# EAGLE design HTTP_POST_RELAY (EAGLE 9.5.2)
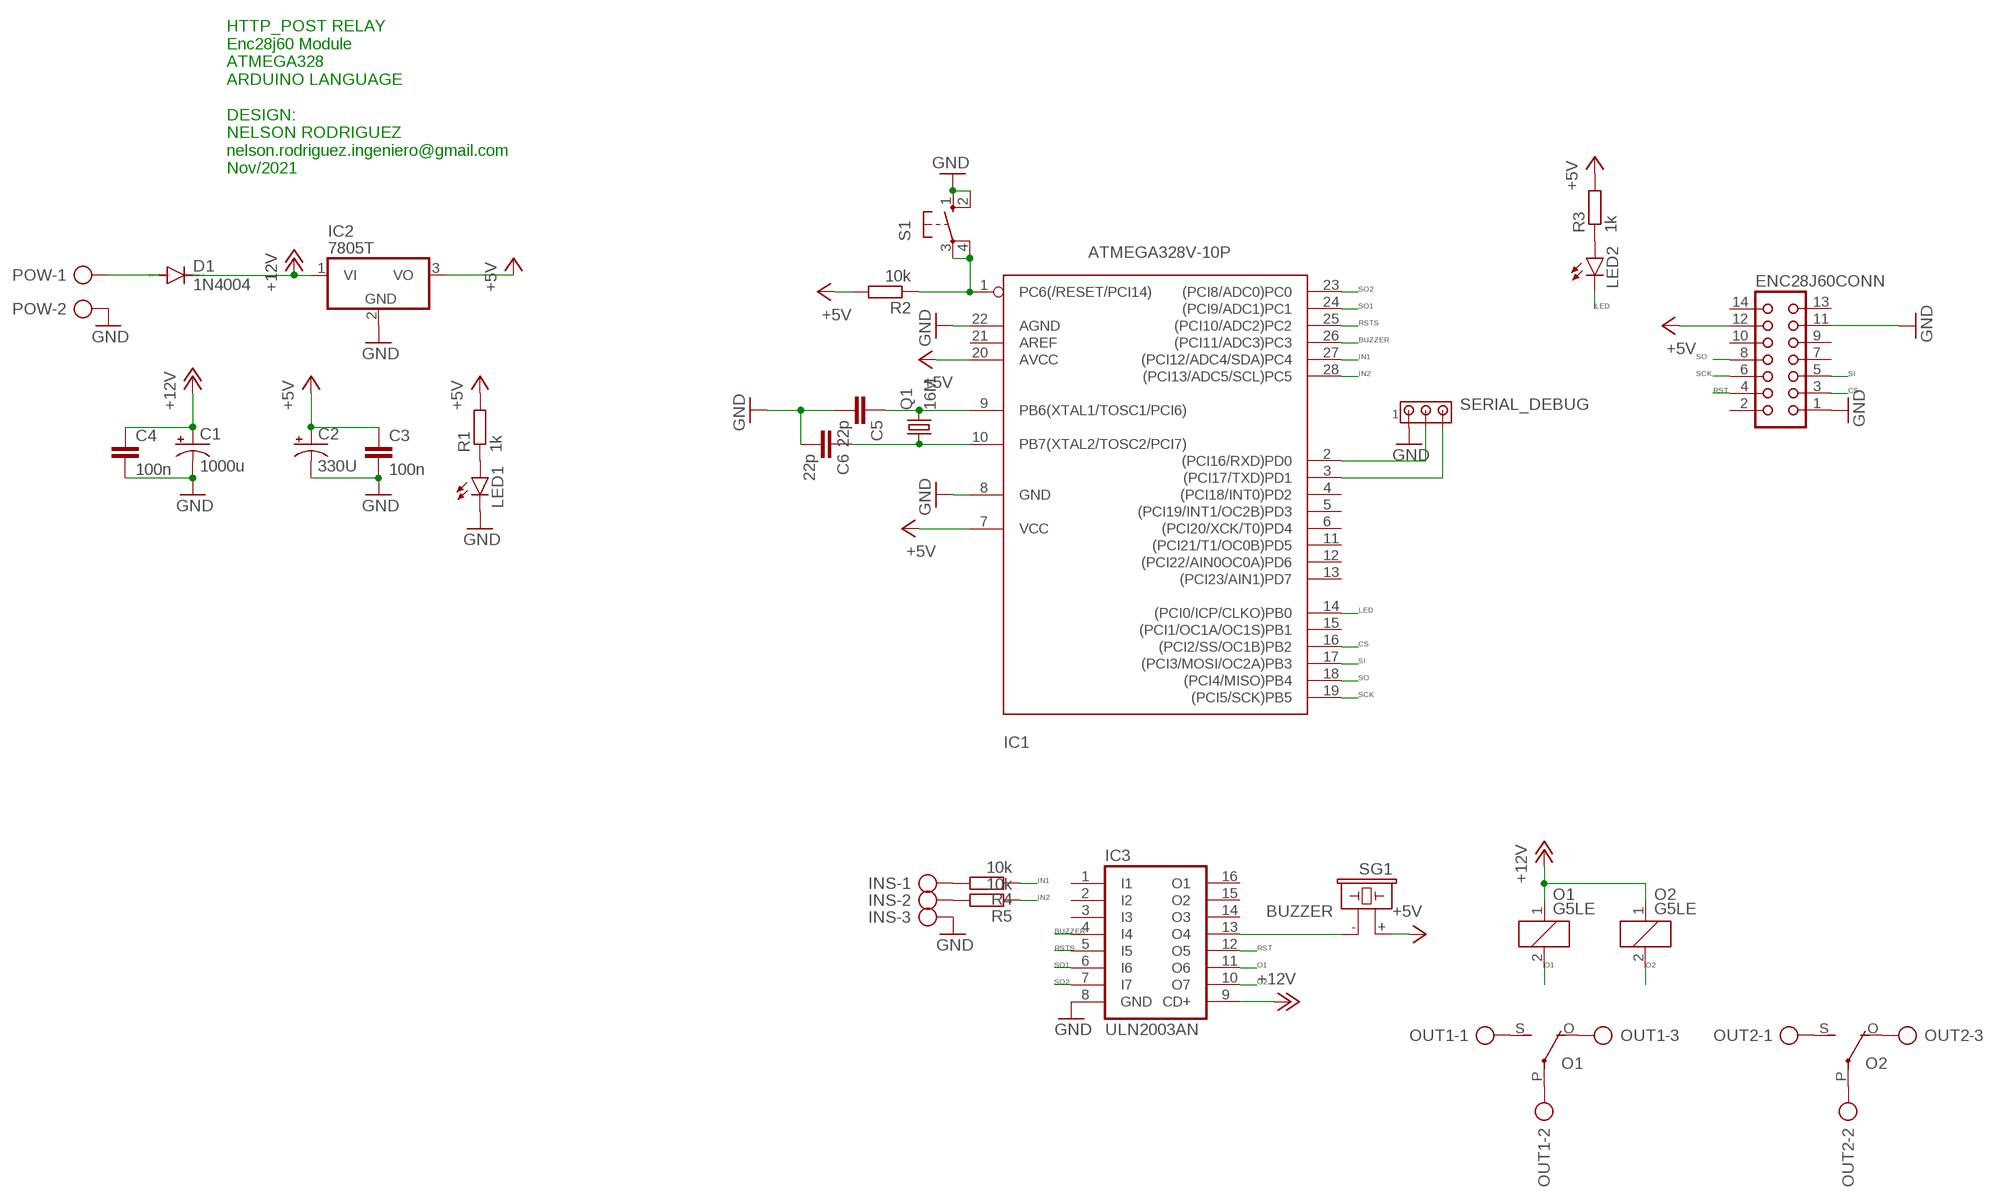
[diagram p0: schematic, sheet 1]

## Parts
C1  1000u  CPOL-USE2.5-6  [E2,5-6]
C2  330U  CPOL-USE2.5-6  [E2,5-6]
C3  100n  C-EU025-024X044  [C025-024X044]
C4  100n  C-EU025-024X044  [C025-024X044]
C5  22p  C-EU025-024X044  [C025-024X044]
C6  22p  C-EU025-024X044  [C025-024X044]
D1  1N4004  [DO41-10]
ENC28J60CONN  CON14  [CON14]
IC1  ATMEGA328V-10P  [DIL28-3]
IC2  7805T  [TO220H]
IC3  ULN2003AN  [DIL16]
INS  AK300/3  [AK300/3]
LED1  LED5MM  [LED5MM]
LED2  LED5MM  [LED5MM]
O1  G5LE  [G5LE]
O2  G5LE  [G5LE]
OUT1  AK300/3  [AK300/3]
OUT2  AK300/3  [AK300/3]
POW  AK300/2  [AK300/2]
Q1  16M  CRYSTALHC49U-V  [HC49U-V]
R1  1k  R-EU_0204/7  [0204/7]
R2  10k  R-EU_0204/7  [0204/7]
R3  1k  R-EU_0204/7  [0204/7]
R4  10k  R-EU_0204/7  [0204/7]
R5  10k  R-EU_0204/7  [0204/7]
S1  10-XX  [B3F-10XX]
SERIAL_DEBUG  MTA03-100  [10X03MTA]
SG1  BUZZER  F/CM12P  [F/CM12P]

## Nets
+5V: C2.+ C3.1 ENC28J60CONN.12 IC1.7(VCC) IC1.20(AVCC) IC2.3(VO) R1.2 R2.2 R3.2 SG1.+
+12V: C1.+ C4.1 D1.C IC2.1(VI) IC3.9(CD+) O1.1 O2.1
BUZZER: IC1.26((PCI11/ADC3)PC3) IC3.4(I4)
CS: ENC28J60CONN.3 IC1.16((PCI2/SS/OC1B)PB2)
GND: C1.- C2.- C3.2 C4.2 C5.2 C6.2 ENC28J60CONN.1 ENC28J60CONN.11 IC1.8(GND) IC1.22(AGND) IC2.2(GND) IC3.8(GND) INS.3 LED1.K(C) POW.2 S1.1(S) S1.2(S1) SERIAL_DEBUG.1
IN1: IC1.27((PCI12/ADC4/SDA)PC4) R4.1
IN2: IC1.28((PCI13/ADC5/SCL)PC5) R5.1
LED: IC1.14((PCI0/ICP/CLKO)PB0) LED2.K(C)
N$1: D1.A POW.1
N$2: LED1.A R1.1
N$3: C6.1 IC1.10(PB7(XTAL2/TOSC2/PCI7)) Q1.1
N$4: C5.1 IC1.9(PB6(XTAL1/TOSC1/PCI6)) Q1.2
N$5: IC1.2((PCI16/RXD)PD0) SERIAL_DEBUG.2
N$6: IC1.1(PC6(/RESET/PCI14)) R2.1 S1.3(P) S1.4(P1)
N$7: IC1.3((PCI17/TXD)PD1) SERIAL_DEBUG.3
N$8: LED2.A R3.1
N$9: IC3.13(O4) SG1.-
N$12: INS.1 R4.2
N$13: INS.2 R5.2
N$14: O1.P(2:P) OUT1.2
N$15: O1.S(2:S) OUT1.1
N$16: O1.O(2:O) OUT1.3
N$17: O2.P(2:P) OUT2.2
N$18: O2.S(2:S) OUT2.1
N$19: O2.O(2:O) OUT2.3
O1: IC3.11(O6) O1.2
O2: IC3.10(O7) O2.2
RST: ENC28J60CONN.4 IC3.12(O5)
RSTS: IC1.25((PCI10/ADC2)PC2) IC3.5(I5)
SCK: ENC28J60CONN.6 IC1.19((PCI5/SCK)PB5)
SI: ENC28J60CONN.5 IC1.17((PCI3/MOSI/OC2A)PB3)
SO: ENC28J60CONN.8 IC1.18((PCI4/MISO)PB4)
SO1: IC1.24((PCI9/ADC1)PC1) IC3.6(I6)
SO2: IC1.23((PCI8/ADC0)PC0) IC3.7(I7)
Unconnected: ENC28J60CONN.2 ENC28J60CONN.7 ENC28J60CONN.9 ENC28J60CONN.10 ENC28J60CONN.13 ENC28J60CONN.14 IC1.4((PCI18/INT0)PD2) IC1.5((PCI19/INT1/OC2B)PD3) IC1.6((PCI20/XCK/T0)PD4) IC1.11((PCI21/T1/OC0B)PD5) IC1.12((PCI22/AIN0OC0A)PD6) IC1.13((PCI23/AIN1)PD7) IC1.15((PCI1/OC1A/OC1S)PB1) IC1.21(AREF) IC3.1(I1) IC3.2(I2) IC3.3(I3) IC3.14(O3) IC3.15(O2) IC3.16(O1)

## Notes on the sheet
- HTTP_POST RELAY
  Enc28j60 Module
  ATMEGA328
  ARDUINO LANGUAGE
  
  DESIGN:
  NELSON RODRIGUEZ
  nelson.rodriguez.ingeniero@gmail.com
  Nov/2021

## Library data of the parts
C1 C2 = rcl-nelson:CPOL-US: POLARIZED CAPACITOR, American symbol; SPICEPREFIX: C
C3-C6 = rcl-nelson:C-EU: CAPACITOR, European symbol; SPICEPREFIX: C
D1 = diode:1N4004: DIODE general purpose rectifier, 1 A
ENC28J60CONN = con-harting-nelson:CON14: CONNECTOR; OC_FARNELL: unknown; OC_NEWARK: unknown
IC1 = atmega328:ATMEGA328*P: MICROCONTROLLER 32 kBytes FLASH 2 kBytes SRAM 1 kBytes EEPROM USART 8-channel 10 bit ADC
IC2 = linear-nelson:78*: Positive VOLTAGE REGULATOR Source: http://cache.national.com/ds/LM/LM78L05.pdf http://www.fairchildsemi.com/ds/LM/LM7805.pdf
IC3 = uln-udn:ULN2003A: DRIVER ARRAY
INS OUT1 OUT2 = con-ptr500:AK300/3: CONNECTOR; OC_FARNELL: unknown; OC_NEWARK: unknown
LED1 LED2 = led:LED: LED OSRAM: - CHIPLED LG R971, LG N971, LY N971, LG Q971, LY Q971, LO R971, LY R971 LH N974, LH R974 LS Q976, LO Q976, LY Q976 LO Q996 - Hyper CHIPLED LW Q18S LB Q993, LB Q99A, LB R99A - SideLED LS A670, LO A670, LY A670, LG A670, LP A670 LB A673, LV A673, LT A673, LW A673 LH A674 LY A675 LS A676, LA A676, LO A676, LY A676, LW A676 LS A679, LY A679, LG A679 - Hyper Micro SIDELED® LS Y876, LA Y876, LO Y876, LY Y876 LT Y87S - SmartLED LW L88C, LW L88S LB L89C, LB L89S, LG L890 LS L89K, LO L89K, LY L89K LS L896, LA L896, LO L896, LY L896 - TOPLED LS T670, LO T670, LY T670, LG T670, LP T670 LSG T670, LSP T670, LSY T670, LOP T670, LYG T670 LG T671, LOG T671, LSG T671 LB T673, LV T673, LT T673, LW T673 LH T674 LS T676, LA T676, LO T676, LY T676, LB T676, LH T676, LSB T676, LW T676 LB T67C, LV T67C, LT T67C, LS T67K, LO T67K, LY T67K, LW E67C LS E67B, LA E67B, LO E67B, LY E67B, LB E67C, LV E67C, LT E67C LW T67C LS T679, LY T679, LG T679 LS T770, LO T770, LY T770, LG T770, LP T770 LB T773, LV T773, LT T773, LW T773 LH T774 LS E675, LA E675, LY E675, LS T675 LS T776, LA T776, LO T776, LY T776, LB T776 LHGB T686 LT T68C, LB T68C - Hyper Mini TOPLED® LB M676 - Mini TOPLED Santana® LG M470 LS M47K, LO M47K, LY M47K Source: http://www.osram.convergy.de LUXEON: - LUMILED® LXK2-PW12-R00, LXK2-PW12-S00, LXK2-PW14-U00, LXK2-PW14-V00 LXK2-PM12-R00, LXK2-PM12-S00, LXK2-PM14-U00 LXK2-PE12-Q00, LXK2-PE12-R00, LXK2-PE12-S00, LXK2-PE14-T00, LXK2-PE14-U00 LXK2-PB12-K00, LXK2-PB12-L00, LXK2-PB12-M00, LXK2-PB14-N00, LXK2-PB14-P00, LXK2-PB14-Q00 LXK2-PR12-L00, LXK2-PR12-M00, LXK2-PR14-Q00, LXK2-PR14-R00 LXK2-PD12-Q00, LXK2-PD12-R00, LXK2-PD12-S00 LXK2-PH12-R00, LXK2-PH12-S00 LXK2-PL12-P00, LXK2-PL12-Q00, LXK2-PL12-R00 Source: www.luxeon.com KINGBRIGHT: KA-3528ASYC Source: www.kingbright.com
O1 O2 = relay:G5LE: RELAY 1 x switch, 10 A/120 V AC, 8 A/30 V DC, Omron; OC_FARNELL: unknown; OC_NEWARK: unknown
POW = con-ptr500:AK300/2: CONNECTOR; OC_FARNELL: unknown; OC_NEWARK: unknown
Q1 = crystal:CRYSTAL: CRYSTAL; OC_FARNELL: 1666969; OC_NEWARK: unknown
R1-R5 = rcl-nelson:R-EU_: RESISTOR, European symbol; SPICEPREFIX: R
S1 = switch-omron:10-XX: OMRON SWITCH; MPN: B3F-1000; OC_FARNELL: 176432; OC_NEWARK: 36M3542
SERIAL_DEBUG = con-amp:MTA03-100: AMP connector
SG1 = buzzer:F/CM12P: BUZZER Source: Buerklin; OC_FARNELL: unknown; OC_NEWARK: unknown

## Board
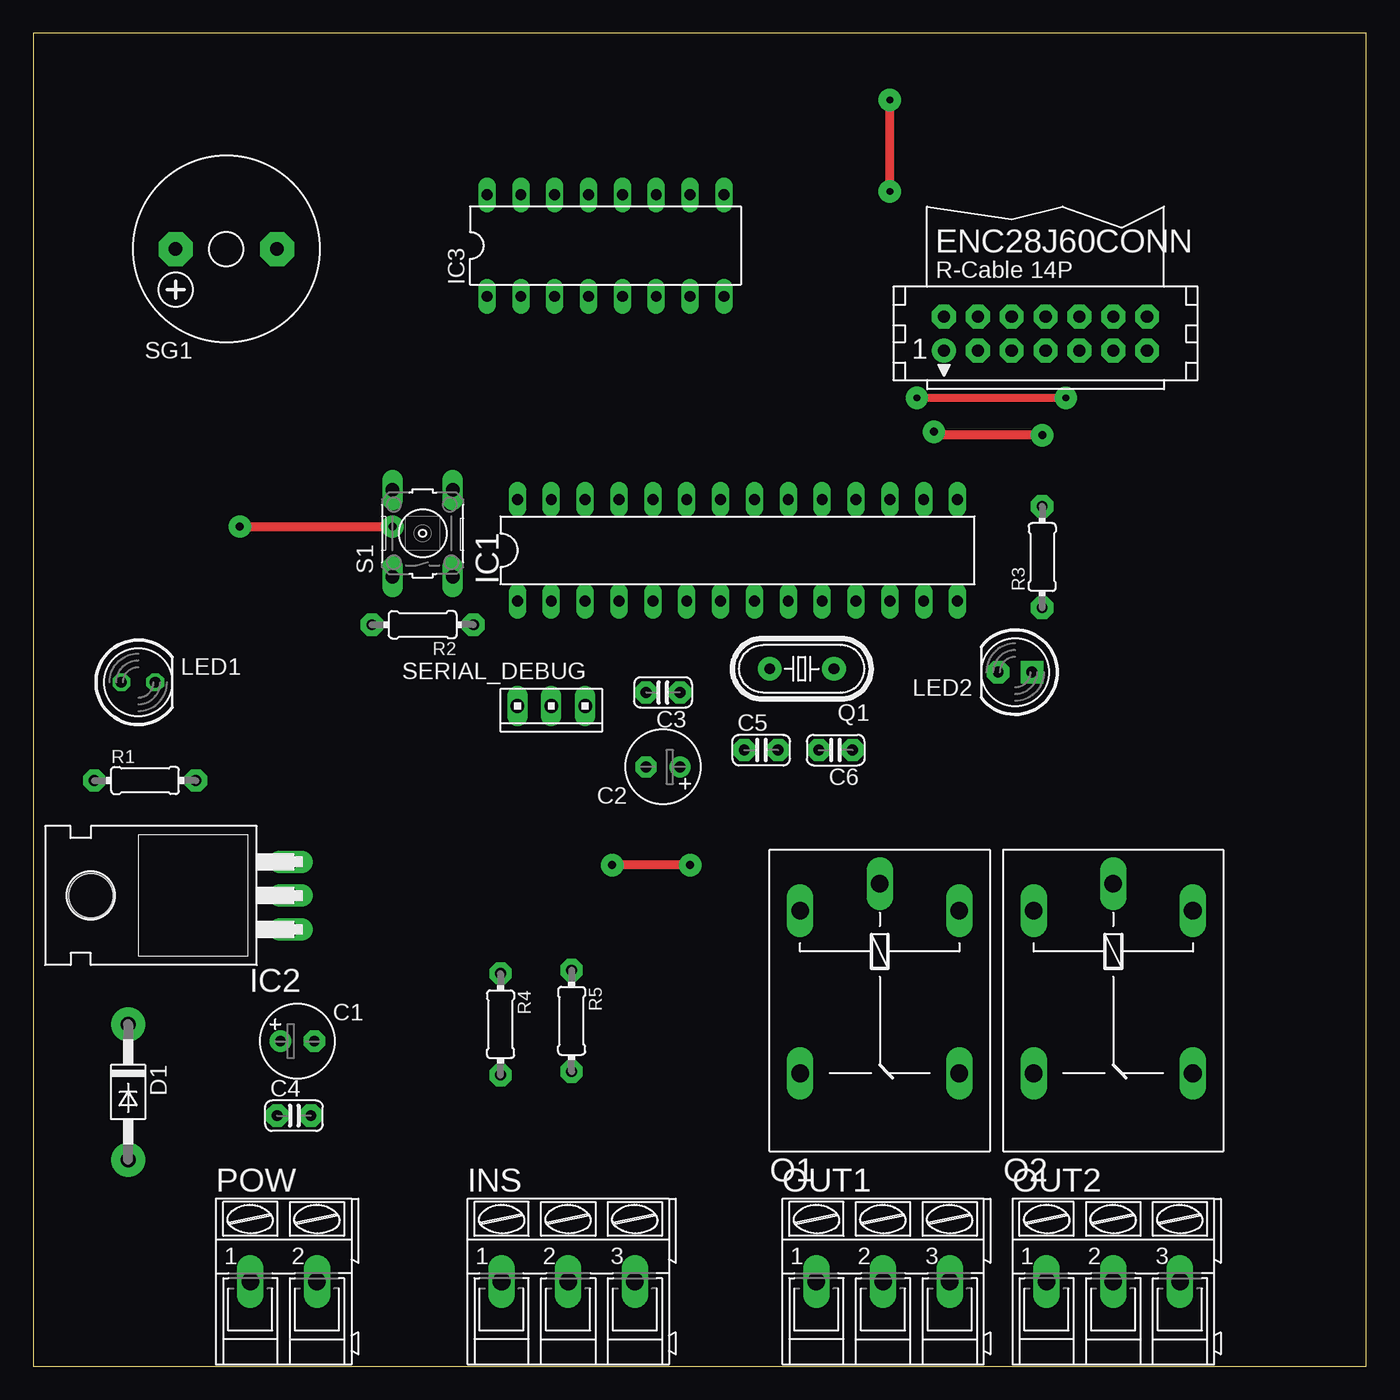
[diagram p1: board, top side]
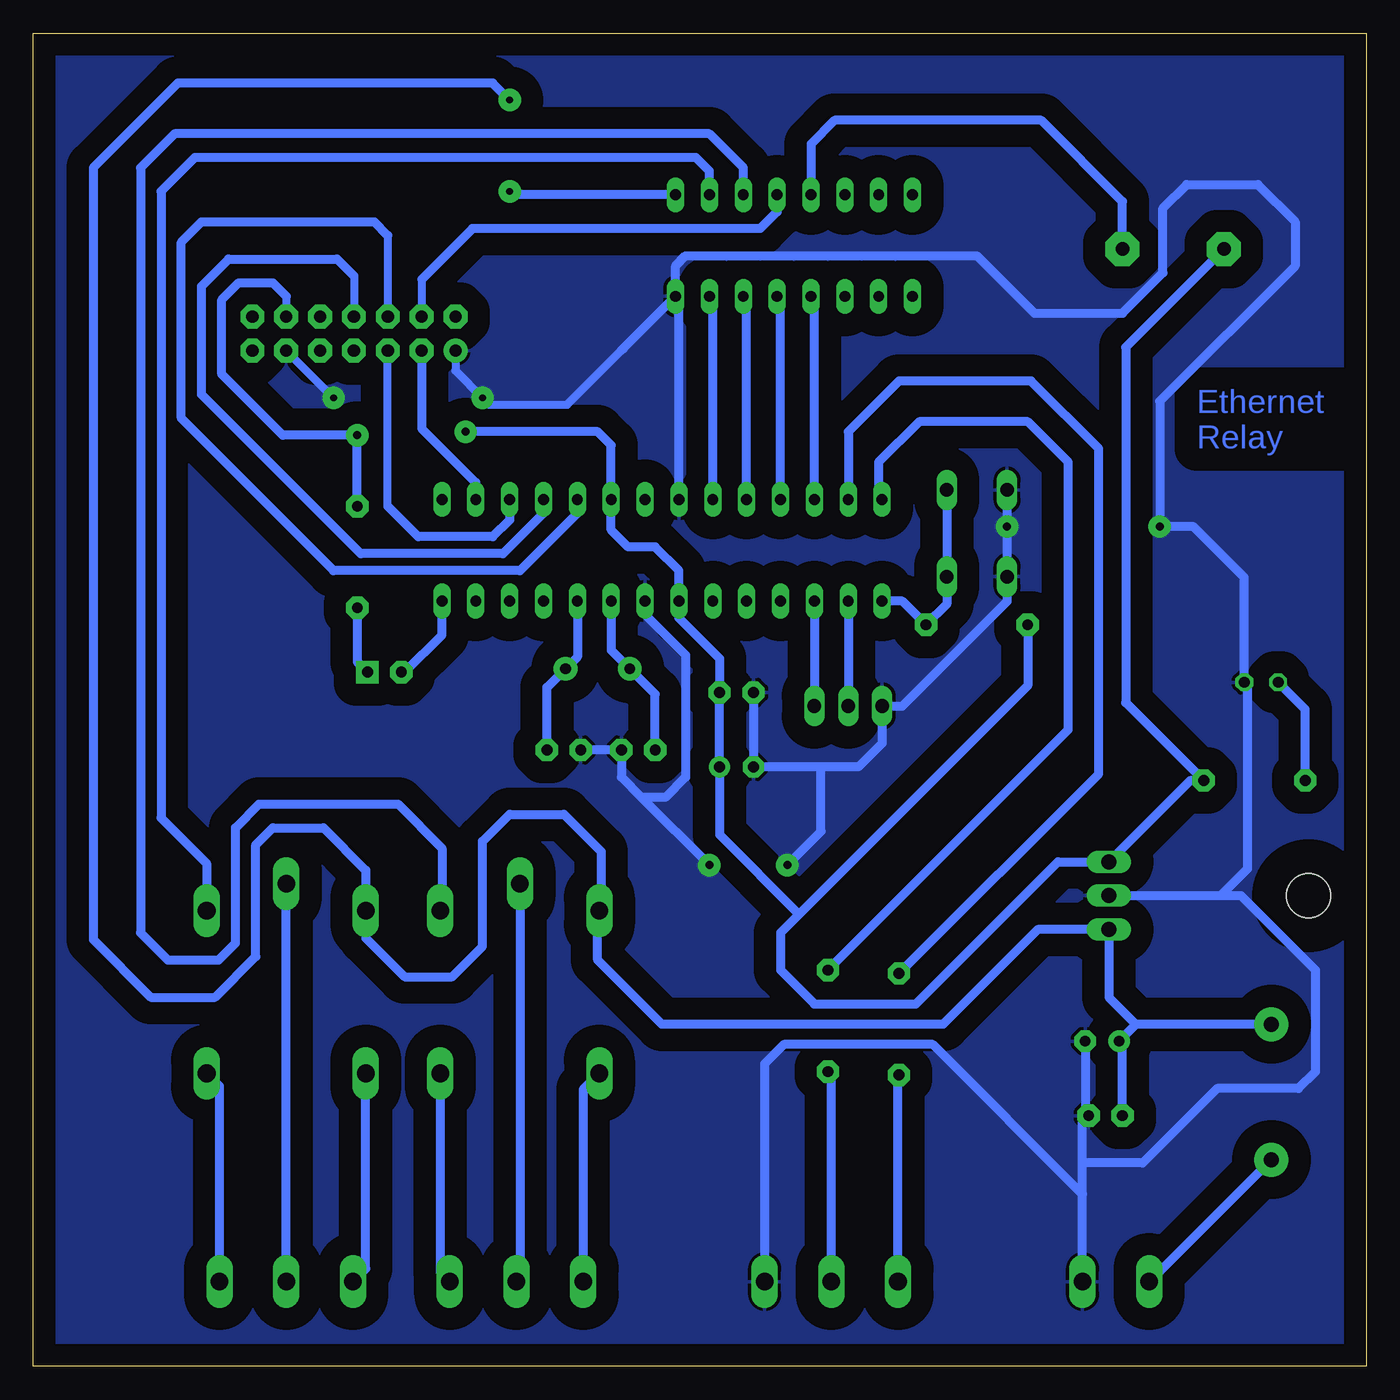
[diagram p2: board, bottom side, seen from below]

Size 100 x 100 mm. Coordinates in mm from the lower left corner, seen from the top.
Outline: 0,0 100,0 100,100 0,100 0,0
Copper layers (1*16): Top 0.035mm / dielectric 1.5mm / Bottom 0.035mm
Design rules "default": minimum track width 6mil, minimum drill 0.35mm, track to track 6mil, track to pad 6mil, pad to pad 6mil, via to via 6mil, smd to smd 6mil, copper to edge 40mil, drill to drill 6mil, minimum pad ring 10mil, minimum via ring 8mil, stop-mask expansion 4mil, vias tented up to drill 0mil, thermal gap 10mil

### Footprints (pad centres in the part's own frame; a part is rotated, then mirrored left to right if it is on the bottom)
E2,5-6 = drill 0.813 pad 1.6: + -1.27,0 | drill 0.813 pad 1.6 octagon: - 1.27,0
C025-024X044 = drill 0.813 pad 1.676 octagon: 1 -1.27,0; 2 1.27,0
DO41-10 = drill 1.118 pad 2.54: A 5.08,0; C -5.08,0
CON14 = drill 0.914 pad 1.778: 1 -7.62,-1.27 | drill 0.914 pad 1.778 octagon: 2 -7.62,1.27; 3 -5.08,-1.27; 4 -5.08,1.27; 5 -2.54,-1.27; 6 -2.54,1.27; 7 0,-1.27; 8 0,1.27; 9 2.54,-1.27; 10 2.54,1.27; 11 5.08,-1.27; 12 5.08,1.27; 13 7.62,-1.27; 14 7.62,1.27
DIL28-3 = drill 0.813 long: 1 -16.51,-3.81; 2 -13.97,-3.81; 3 -11.43,-3.81; 4 -8.89,-3.81; 5 -6.35,-3.81; 6 -3.81,-3.81; 7 -1.27,-3.81; 8 1.27,-3.81; 9 3.81,-3.81; 10 6.35,-3.81; 11 8.89,-3.81; 12 11.43,-3.81; 13 13.97,-3.81; 14 16.51,-3.81; 15 16.51,3.81; 16 13.97,3.81; 17 11.43,3.81; 18 8.89,3.81; 19 6.35,3.81; 20 3.81,3.81; 21 1.27,3.81; 22 -1.27,3.81; 23 -3.81,3.81; 24 -6.35,3.81; 25 -8.89,3.81; 26 -11.43,3.81; 27 -13.97,3.81; 28 -16.51,3.81
TO220H = drill 1.118 long: 1 -2.54,-10.16; 2 0,-10.16; 3 2.54,-10.16 | hole 3.302: 0,4.826
DIL16 = drill 0.813 long: 1 -8.89,-3.81; 2 -6.35,-3.81; 3 -3.81,-3.81; 4 -1.27,-3.81; 5 1.27,-3.81; 6 3.81,-3.81; 7 6.35,-3.81; 8 8.89,-3.81; 9 8.89,3.81; 10 6.35,3.81; 11 3.81,3.81; 12 1.27,3.81; 13 -1.27,3.81; 14 -3.81,3.81; 15 -6.35,3.81; 16 -8.89,3.81
AK300/3 = drill 1.321 long: 1 -5.004,0; 2 0,0; 3 5.004,0
LED5MM = drill 0.813 octagon: A -1.27,0; K 1.27,0
LED5MM' = drill 0.813 pad 1.676 square: A -1.27,0 | drill 0.813 pad 1.676 octagon: K 1.27,0
G5LE = drill 1.321 long: 1 -7.493,-5.969; 2 -7.493,5.969; O 4.699,5.969; P -9.525,0; S 4.699,-5.969
AK300/2 = drill 1.321 long: 1 -2.515,0; 2 2.489,0
HC49U-V = drill 0.813 pad 1.778: 1 -2.413,0; 2 2.413,0
0204/7 = drill 0.813 pad 1.676 octagon: 1 -3.81,0; 2 3.81,0
B3F-10XX = drill 1.016 long: 1 -3.251,2.261; 2 3.251,2.261; 3 -3.251,-2.261; 4 3.251,-2.261
10X03MTA = drill 1.016 long: 1 2.54,0; 2 0,0; 3 -2.54,0
F/CM12P = drill 1.016 pad 2.54 octagon: + 3.81,0; - -3.81,0

### Placement (x,y rotation side)
C1  19.81,24.38 0 top
C2  47.24,44.96 180 top
C3  47.24,50.55 180 top
C4  19.56,18.8 0 top
C5  54.61,46.23 0 top
C6  60.2,46.23 180 top
D1  7.11,20.57 270 top
ENC28J60CONN  75.95,77.47 0 top
IC1  52.83,61.21 0 top
IC2  9.14,35.31 90 top
IC3  42.93,84.07 0 top
INS  40.13,6.35 0 top
LED1  7.87,51.31 0 top
LED2  [LED5MM']  73.66,52.07 180 top
O1  63.5,26.67 270 top
O2  81.03,26.67 270 top
OUT1  63.75,6.35 0 top
OUT2  81.03,6.35 0 top
POW  18.8,6.35 0 top
Q1  57.66,52.32 180 top
R1  8.38,43.94 0 top
R2  29.21,55.63 180 top
R3  75.69,60.71 90 top
R4  35.05,25.65 270 top
R5  40.39,25.91 270 top
S1  29.21,62.48 90 top
SERIAL_DEBUG  38.86,49.53 180 top
SG1  14.48,83.82 180 top

### Tracks (layer width: path | path; a pad name or v marks a point on that pad's centre or on a via)
+5V  (via drill 0.6 pad 1.68)
  Top 0.66: v75.69,69.85 67.82,69.85 v67.56,70.1
  Bottom 0.61: 81.03,80.26 ENC28J60CONN.12
  Bottom 0.66: R2.2 25.4,51.05 42.55,33.91 | 42.55,33.91 43.94,32.51 43.94,29.72 41.4,27.18 33.78,27.18 23.11,37.85 IC2.3 13.21,43.94 R1.2 18.03,49.78 18.03,76.45 SG1.+ | 42.55,33.91 48.51,39.88 C2.+ C3.1 48.51,53.09 51.56,56.13 IC1.7 51.56,59.69 53.34,61.47 55.37,61.47 56.64,62.74 IC1.20 56.64,69.09 57.66,70.1 v67.56,70.1 | 81.03,80.26 82.04,81.28 84.58,81.28 85.85,80.01 85.85,74.42 81.28,69.85 v75.69,69.85 R3.2
+12V  (via drill 0.51 pad 1.68)
  Top 0.66: v64.26,88.14 v64.26,95
  Bottom 0.66: D1.C 17.27,25.65 | 17.27,25.65 C1.+ 18.29,24.13 C4.1 | 17.27,25.65 19.3,27.69 IC2.1 24.64,32.77 31.75,25.65 52.83,25.65 57.66,30.48 57.66,34.04 O1.1 57.4,34.29 57.4,38.61 60.2,41.4 64.26,41.4 66.29,39.37 66.29,31.5 68.58,29.21 72.14,29.21 75.06,32.13 O2.1 75.06,37.21 78.23,40.39 82.04,40.39 83.31,39.12 83.31,30.73 86.36,27.69 91.19,27.69 95.5,32 95.5,89.92 89.15,96.27 65.53,96.27 v64.26,95 | IC3.9 64.01,87.88 v64.26,88.14
BUZZER
  Bottom 0.66: IC1.26 41.4,80.01 IC3.4
CS
  Bottom 0.66: ENC28J60CONN.3 70.87,70.36 66.8,66.29 IC1.16
GND  (via drill 0.51 pad 1.68, 0.6 pad 1.68)
  Top 0.61: v77.47,72.64 v66.29,72.64
  Top 0.66: v15.49,62.99 v26.95,62.99 | v49.28,37.59 v43.43,37.59
  Bottom 0.61: ENC28J60CONN.11 v77.47,72.64 | 55.75,76.33 59.94,72.14 65.79,72.14 v66.29,72.64 68.33,74.68 ENC28J60CONN.1
  Bottom 0.66: IC1.22 51.56,80.01 IC3.8 | 55.88,76.2 55.75,76.33 IC3.8 | 21.29,15.24 POW.2 21.29,12.9 32.51,24.13 43.69,24.13 45.14,22.68 INS.3 | 21.29,15.24 21.29,18.34 C4.2 21.08,19.05 C1.- | S1.2 v26.95,62.99 S1.1 26.92,59.21 26.92,57.4 34.8,49.53 SERIAL_DEBUG.1 36.32,46.74 38.1,44.96 40.89,44.96 | C6.2 C5.2 55.88,44.2 54.36,42.67 | C3.2 C2.- 40.89,44.96 | IC1.8 54.1,56.39 51.05,53.34 51.05,44.2 52.58,42.67 54.36,42.67 | 21.29,15.24 16.76,15.24 11.18,20.83 5.08,20.83 3.81,22.1 3.81,29.72 9.4,35.31 IC2.2 10.92,35.31 8.89,37.34 8.89,51.05 LED1.K 9.14,59.18 12.95,62.99 v15.49,62.99 15.49,72.39 5.33,82.55 5.33,85.85 8.13,88.65 13.46,88.65 15.24,86.87 15.24,82.04 18.29,78.99 24.89,78.99 29.21,83.31 51.05,83.31 51.82,82.55 IC3.8 | 54.36,42.67 v49.28,37.59 | 40.89,44.96 40.89,40.13 v43.43,37.59
  pour Bottom (isolate 1.676): 0,0 101.6,0 101.6,101.6 0,101.6
IN1
  Bottom 0.66: R4.1 20.07,44.45 20.07,68.83 25.15,73.91 35.05,73.91 38.86,70.1 IC1.27
IN2
  Bottom 0.66: R5.1 22.35,47.75 22.35,67.82 25.4,70.87 33.53,70.87 36.58,67.82 36.58,65.28 IC1.28
LED
  Bottom 0.66: LED2.K 72.14,52.07 69.34,54.86 IC1.14
N$1
  Bottom 0.66: POW.1 16.26,6.35 D1.A
N$2
  Bottom 0.66: R1.1 4.57,49.28 LED1.A
N$3
  Bottom 0.66: IC1.10 59.18,53.21 Q1.1 61.47,50.93 C6.1
N$4
  Bottom 0.66: C5.1 53.34,50.42 Q1.2 56.64,53.72 IC1.9
N$5
  Bottom 0.66: IC1.2 SERIAL_DEBUG.2
N$6
  Bottom 0.66: IC1.1 34.8,57.4 R2.1 31.47,57.17 S1.3 S1.4
N$7
  Bottom 0.66: IC1.3 SERIAL_DEBUG.3
N$8
  Bottom 0.66: R3.1 75.69,52.83 LED2.A
N$9
  Bottom 0.66: SG1.- 18.29,87.38 24.38,93.47 39.88,93.47 41.66,91.69 IC3.13
N$12
  Bottom 0.66: INS.1 35.13,21.77 R4.2
N$13
  Bottom 0.66: INS.2 40.13,21.84 R5.2
N$14
  Bottom 0.66: O1.P 63.5,7.37 63.75,7.11 OUT1.2
N$15
  Bottom 0.66: O1.S 58.75,20.75 OUT1.1
N$16
  Bottom 0.66: O1.O 69.47,7.06 OUT1.3
N$17
  Bottom 0.66: OUT2.2 O2.P
N$18
  Bottom 0.66: OUT2.1 75.06,7.32 O2.S
N$19
  Bottom 0.66: OUT2.3 86.03,21.01 O2.O
O1
  Bottom 0.66: IC3.11 46.74,89.92 49.28,92.46 89.41,92.46 91.95,89.92 91.95,32.51 89.92,30.48 86.11,30.48 84.84,31.75 84.84,40.39 83.06,42.16 72.64,42.16 69.34,38.86 69.34,34.29 O1.2
O2
  Bottom 0.66: IC3.10 49.28,89.66 50.29,90.68 87.88,90.68 90.42,88.14 90.42,41.15 87,37.72 O2.2
RST
  Bottom 0.61: 70.87,81.53 ENC28J60CONN.4
  Bottom 0.66: IC3.12 44.2,86.61 45.47,85.34 67.06,85.34 70.87,81.53
RSTS
  Bottom 0.66: IC1.25 43.94,80.01 IC3.5
SCK
  Bottom 0.61: 73.41,84.84 ENC28J60CONN.6
  Bottom 0.66: IC1.19 59.18,64.01 63.5,59.69 77.47,59.69 88.9,71.12 88.9,84.33 87.38,85.85 74.42,85.85 73.41,84.84
SI
  Bottom 0.61: 73.41,64.52 ENC28J60CONN.5
  Bottom 0.66: IC1.17 64.26,63.5 65.53,62.23 71.12,62.23 73.41,64.52
SO
  Bottom 0.61: 75.95,81.79 ENC28J60CONN.8
  Bottom 0.66: IC1.18 61.72,64.01 64.77,60.96 75.44,60.96 87.38,72.9 87.38,81.03 85.34,83.06 77.22,83.06 75.95,81.79
SO1
  Bottom 0.66: IC1.24 46.48,80.01 IC3.6
SO2
  Bottom 0.66: IC1.23 49.02,80.01 IC3.7

### Text on the board
Bottom: Ethernet / Relay